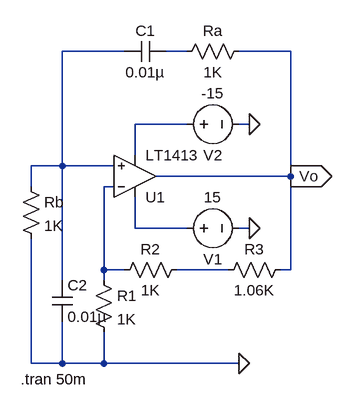
[diagram p0: schematic Run_1.asc]
Run_1.asc, the LTspice schematic file:
Version 4
SHEET 1 956 680
WIRE 592 -192 496 -192
WIRE 688 -192 656 -192
WIRE 848 -192 768 -192
WIRE 688 -80 608 -80
WIRE 784 -80 768 -80
WIRE 608 -32 608 -80
WIRE 496 -16 496 -192
WIRE 496 -16 448 -16
WIRE 576 -16 496 -16
WIRE 848 0 848 -192
WIRE 848 0 640 0
WIRE 448 16 448 -16
WIRE 576 16 560 16
WIRE 608 80 608 32
WIRE 688 80 608 80
WIRE 784 80 768 80
WIRE 560 144 560 16
WIRE 592 144 560 144
WIRE 752 144 672 144
WIRE 848 144 848 0
WIRE 848 144 832 144
WIRE 496 160 496 -16
WIRE 560 160 560 144
WIRE 448 288 448 96
WIRE 496 288 496 224
WIRE 496 288 448 288
WIRE 560 288 560 240
WIRE 560 288 496 288
WIRE 768 288 560 288
FLAG 784 -80 0
FLAG 784 80 0
FLAG 768 288 0
FLAG 848 0 Vo
IOPIN 848 0 Out
SYMBOL cap 656 -208 R90
WINDOW 0 0 32 VBottom 2
WINDOW 3 32 32 VTop 2
SYMATTR InstName C1
SYMATTR Value 0.01µ
SYMBOL res 784 -208 R90
WINDOW 0 0 56 VBottom 2
WINDOW 3 32 56 VTop 2
SYMATTR InstName Ra
SYMATTR Value 1K
SYMBOL OpAmps\\LT1413 608 64 M180
SYMATTR InstName U1
SYMBOL voltage 672 80 M90
WINDOW 0 32 56 VTop 2
WINDOW 3 -32 56 VBottom 2
WINDOW 123 0 0 Left 0
WINDOW 39 0 0 Left 0
SYMATTR InstName V1
SYMATTR Value 15
SYMBOL voltage 672 -80 M90
WINDOW 0 32 56 VTop 2
WINDOW 3 -32 56 VBottom 2
WINDOW 123 0 0 Left 0
WINDOW 39 0 0 Left 0
SYMATTR InstName V2
SYMATTR Value -15
SYMBOL res 544 144 R0
SYMATTR InstName R1
SYMATTR Value 1K
SYMBOL cap 480 160 R0
SYMATTR InstName C2
SYMATTR Value 0.01µ
SYMBOL res 432 0 R0
SYMATTR InstName Rb
SYMATTR Value 1K
SYMBOL res 688 128 R90
WINDOW 0 0 56 VBottom 2
WINDOW 3 32 56 VTop 2
SYMATTR InstName R2
SYMATTR Value 1K
SYMBOL res 848 128 R90
WINDOW 0 0 56 VBottom 2
WINDOW 3 32 56 VTop 2
SYMATTR InstName R3
SYMATTR Value 1.06K
TEXT 432 312 Left 2 !.tran 50m

The netlist it stands for:
* Run_1.asc
C1 N002 N001 0.01µ
Ra Vo N002 1K
XU1 N001 N004 N005 N003 Vo LT1413  ; pins In+ In- V+ V- OUT
V1 N005 0 15
V2 N003 0 -15
R1 N004 0 1K
C2 N001 0 0.01µ
Rb N001 0 1K
R2 N006 N004 1K
R3 Vo N006 1.06K
.tran 50m
.lib LTC.lib
.backanno
.end